# EAGLE design rc2014_16550 (EAGLE 8.1.0)
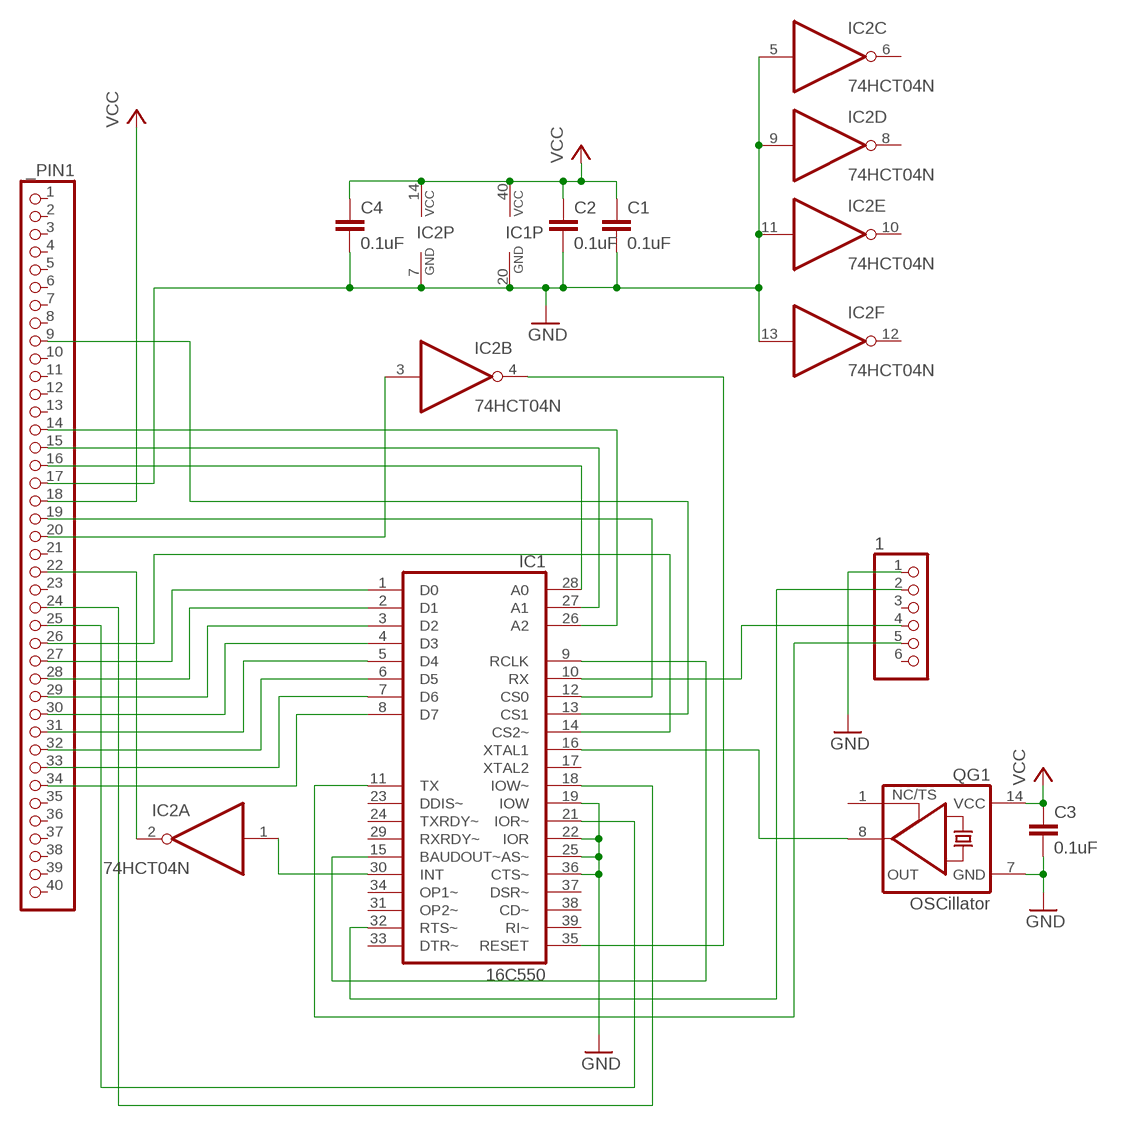
[diagram p0: schematic, sheet 1]

## Parts
1  PINHD-1X6  [1X06]
_PIN1  PINHD-1X40  [1X40]
C1  0.1uF  C-EU050-024X044  [C050-024X044]
C2  0.1uF  C-EU050-024X044  [C050-024X044]
C3  0.1uF  C-EU050-024X044  [C050-024X044]
C4  0.1uF  C-EU050-024X044  [C050-024X044]
IC1  16C550  XR-16C550P  [DIL40]
IC2  74HCT04N  [DIL14]
QG1  OSCillator  XO-14  [DIL14S]

## Nets
/INT: _PIN1.22 IC2.2(A:O)
/IORQ: _PIN1.26 IC1.14(CS2~)
/M1: _PIN1.19 IC1.12(CS0)
/RD: _PIN1.25 IC1.21(IOR~)
/RST: _PIN1.20 IC2.3(B:I)
/RTS: 1.2 IC1.32(RTS~)
/WR: _PIN1.24 IC1.18(IOW~)
A0: _PIN1.16 IC1.28(A0)
A1: _PIN1.15 IC1.27(A1)
A2: _PIN1.14 IC1.26(A2)
A7: _PIN1.9 IC1.13(CS1)
D0: _PIN1.27 IC1.1(D0)
D1: _PIN1.28 IC1.2(D1)
D2: _PIN1.29 IC1.3(D2)
D3: _PIN1.30 IC1.4(D3)
D4: _PIN1.31 IC1.5(D4)
D5: _PIN1.32 IC1.6(D5)
D6: _PIN1.33 IC1.7(D6)
D7: _PIN1.34 IC1.8(D7)
GND: 1.1 _PIN1.17 C1.2 C2.2 C3.2 C4.2 IC1.19(IOW) IC1.20(GND) IC1.22(IOR) IC1.25(AS~) IC1.36(CTS~) IC2.5(C:I) IC2.7(P:GND) IC2.9(D:I) IC2.11(E:I) IC2.13(F:I) QG1.7(GND)
INT: IC1.30(INT) IC2.1(A:I)
N$14: IC1.9(RCLK) IC1.15(BAUDOUT~)
OSC: IC1.16(XTAL1) QG1.8(OUT)
RESET: IC1.35(RESET) IC2.4(B:O)
RX: 1.4 IC1.10(RX)
TX: 1.5 IC1.11(TX)
VCC: _PIN1.18 C1.1 C2.1 C3.1 C4.1 IC1.40(VCC) IC2.14(P:VCC) QG1.14(VCC)
Unconnected: 1.3 1.6 _PIN1.1 _PIN1.2 _PIN1.3 _PIN1.4 _PIN1.5 _PIN1.6 _PIN1.7 _PIN1.8 _PIN1.10 _PIN1.11 _PIN1.12 _PIN1.13 _PIN1.21 _PIN1.23 _PIN1.35 _PIN1.36 _PIN1.37 _PIN1.38 _PIN1.39 _PIN1.40 IC1.17(XTAL2) IC1.23(DDIS~) IC1.24(TXRDY~) IC1.29(RXRDY~) IC1.31(OP2~) IC1.33(DTR~) IC1.34(OP1~) IC1.37(DSR~) IC1.38(CD~) IC1.39(RI~) IC2.6(C:O) IC2.8(D:O) IC2.10(E:O) IC2.12(F:O) QG1.1(TS)

## Library data of the parts
1 = pinhead:PINHD-1X6: PIN HEADER
_PIN1 = pinhead:PINHD-1X40: PIN HEADER
C1-C4 = rcl:C-EU: CAPACITOR, European symbol
IC1 = exar:XR-16C550P: UART/FIFO; MPN: ST16C450CP40; OC_FARNELL: 1294801; OC_NEWARK: 24R1445
IC2 = 74xx-eu:74*04: Hex INVERTER
QG1 = crystal:XO-: CRYSTAL; OC_FARNELL: unknown; OC_NEWARK: unknown

## Net classes
0 +5V: width 0.508 mm

## Board
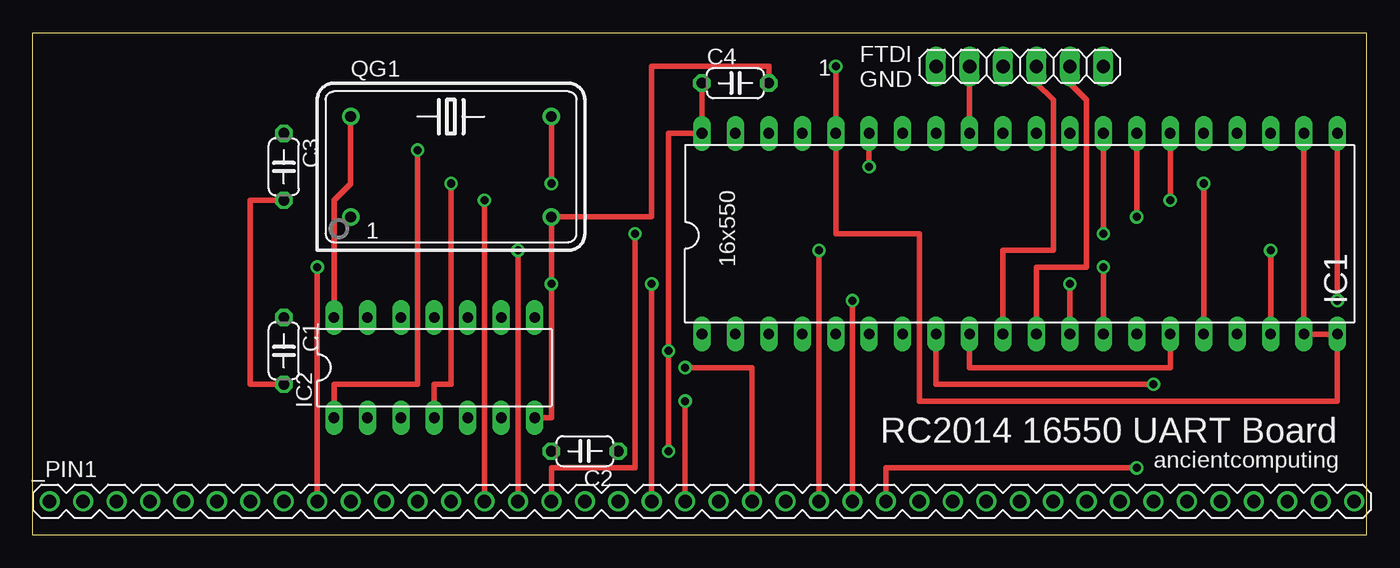
[diagram p1: board, top side]
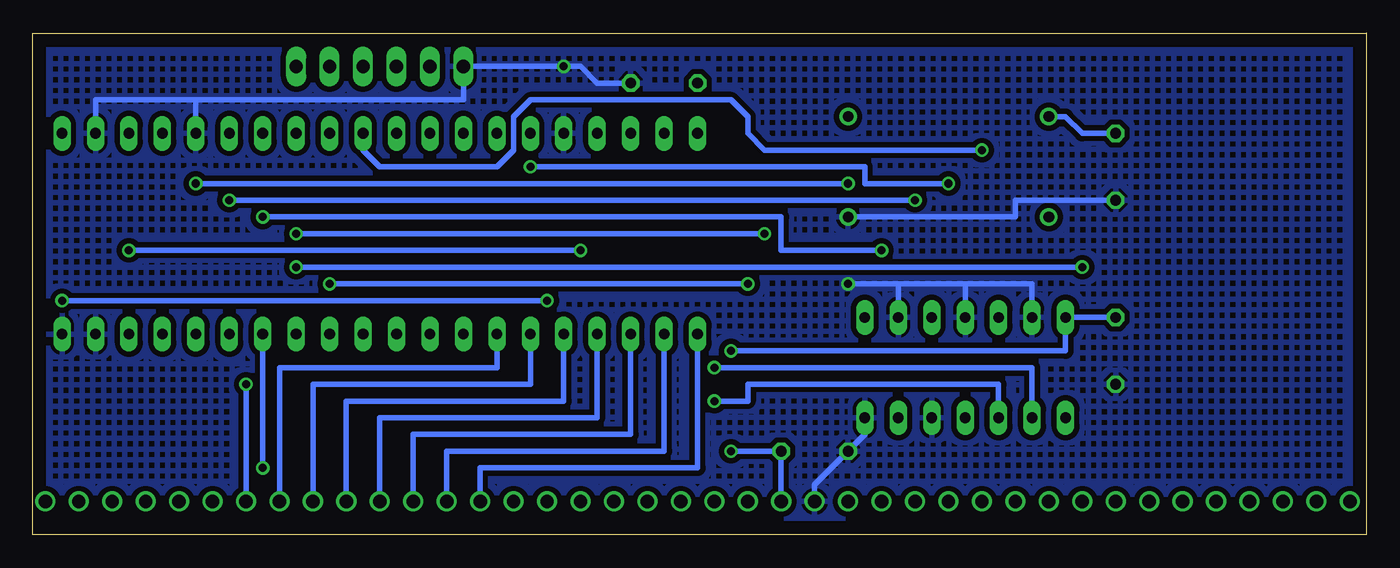
[diagram p2: board, bottom side, seen from below]

Size 101.27 x 38.1 mm. Coordinates in mm from the lower left corner, seen from the top.
Outline: 0,38.09 101.27,38.09 101.27,0 0,0 0,38.09
Outline: 0,38.09 0,38.1
Copper layers (1*16): Top 0.035mm / dielectric 1.5mm / Bottom 0.035mm
Design rules "default *": minimum track width 20mil, minimum drill 24mil, track to track 8mil, track to pad 8mil, pad to pad 8mil, via to via 8mil, smd to smd 8mil, copper to edge 40mil, drill to drill 8mil, minimum pad ring 10mil, minimum via ring 8mil, stop-mask expansion 4mil, vias tented up to drill 0mil, thermal gap 10mil

### Footprints (pad centres in the part's own frame; a part is rotated, then mirrored left to right if it is on the bottom)
1X06 = drill 1.016 long: 1 -6.35,0; 2 -3.81,0; 3 -1.27,0; 4 1.27,0; 5 3.81,0; 6 6.35,0
1X40 = drill 1.016: 1 -49.53,0; 2 -46.99,0; 3 -44.45,0; 4 -41.91,0; 5 -39.37,0; 6 -36.83,0; 7 -34.29,0; 8 -31.75,0; 9 -29.21,0; 10 -26.67,0; 11 -24.13,0; 12 -21.59,0; 13 -19.05,0; 14 -16.51,0; 15 -13.97,0; 16 -11.43,0; 17 -8.89,0; 18 -6.35,0; 19 -3.81,0; 20 -1.27,0; 21 1.27,0; 22 3.81,0; 23 6.35,0; 24 8.89,0; 25 11.43,0; 26 13.97,0; 27 16.51,0; 28 19.05,0; 29 21.59,0; 30 24.13,0; 31 26.67,0; 32 29.21,0; 33 31.75,0; 34 34.29,0; 35 36.83,0; 36 39.37,0; 37 41.91,0; 38 44.45,0; 39 46.99,0; 40 49.53,0
C050-024X044 = drill 0.813 octagon: 1 -2.54,0; 2 2.54,0
DIL40 = drill 0.813 long: 1 -24.13,-7.62; 2 -21.59,-7.62; 3 -19.05,-7.62; 4 -16.51,-7.62; 5 -13.97,-7.62; 6 -11.43,-7.62; 7 -8.89,-7.62; 8 -6.35,-7.62; 9 -3.81,-7.62; 10 -1.27,-7.62; 11 1.27,-7.62; 12 3.81,-7.62; 13 6.35,-7.62; 14 8.89,-7.62; 15 11.43,-7.62; 16 13.97,-7.62; 17 16.51,-7.62; 18 19.05,-7.62; 19 21.59,-7.62; 20 24.13,-7.62; 21 24.13,7.62; 22 21.59,7.62; 23 19.05,7.62; 24 16.51,7.62; 25 13.97,7.62; 26 11.43,7.62; 27 8.89,7.62; 28 6.35,7.62; 29 3.81,7.62; 30 1.27,7.62; 31 -1.27,7.62; 32 -3.81,7.62; 33 -6.35,7.62; 34 -8.89,7.62; 35 -11.43,7.62; 36 -13.97,7.62; 37 -16.51,7.62; 38 -19.05,7.62; 39 -21.59,7.62; 40 -24.13,7.62
DIL14 = drill 0.813 long: 1 -7.62,-3.81; 2 -5.08,-3.81; 3 -2.54,-3.81; 4 0,-3.81; 5 2.54,-3.81; 6 5.08,-3.81; 7 7.62,-3.81; 8 7.62,3.81; 9 5.08,3.81; 10 2.54,3.81; 11 0,3.81; 12 -2.54,3.81; 13 -5.08,3.81; 14 -7.62,3.81
DIL14S = drill 0.813: 1 -7.62,-3.81; 7 7.62,-3.81; 8 7.62,3.81; 14 -7.62,3.81

### Placement (x,y rotation side)
1  74.93,35.56 0 top
_PIN1  50.8,2.54 0 top
C1  19.05,13.97 270 top
C2  41.91,6.35 180 top
C3  19.05,27.94 270 top
C4  53.34,34.29 0 top
IC1  74.93,22.86 0 top
IC2  30.48,12.7 0 top
QG1  31.75,27.94 0 top

### Tracks (layer width: path | path; a pad name or v marks a point on that pad's centre or on a via)
/INT  (via drill 0.61)
  Top 0.406: _PIN1.22 54.61,12.7 v49.53,12.7
  Bottom 0.406: v49.53,12.7 25.4,12.7 IC2.2
/IORQ  (via drill 0.61)
  Top 0.406: v83.82,5.08 64.77,5.08 _PIN1.26
  Bottom 0.406: IC1.14 v83.82,5.08
/M1  (via drill 0.61)
  Top 0.406: _PIN1.19 v46.99,19.05 | v78.74,19.05 IC1.12
  Bottom 0.406: v46.99,19.05 v78.74,19.05
/RD  (via drill 0.61)
  Top 0.406: _PIN1.25 v62.23,17.78 | IC1.21 v99.06,17.78
  Bottom 0.406: v99.06,17.78 v62.23,17.78
/RST  (via drill 0.61)
  Top 0.406: _PIN1.20 v49.53,10.16
  Bottom 0.406: IC2.3 27.94,11.43 46.99,11.43 46.99,10.16 v49.53,10.16
/RTS
  Top 0.406: 1.2 IC1.32
/WR  (via drill 0.61)
  Top 0.406: _PIN1.24 v59.69,21.59 | v93.98,21.59 IC1.18
  Bottom 0.406: v59.69,21.59 v93.98,21.59
A0  (via drill 0.61)
  Top 0.406: v45.72,22.86 45.72,5.08 39.37,5.08 _PIN1.16 | IC1.28 v81.28,22.86
  Bottom 0.406: v45.72,22.86 v81.28,22.86
A1  (via drill 0.61)
  Top 0.406: _PIN1.15 v36.83,21.59 | IC1.27 v83.82,24.13
  Bottom 0.406: v36.83,21.59 44.45,21.59 44.45,24.13 v83.82,24.13
A2  (via drill 0.61)
  Top 0.406: _PIN1.14 v34.29,25.4 | IC1.26 v86.36,25.4
  Bottom 0.406: v34.29,25.4 v86.36,25.4
A7  (via drill 0.61)
  Top 0.406: v21.59,20.32 _PIN1.9 | v81.28,20.32 IC1.13
  Bottom 0.406: v21.59,20.32 v81.28,20.32
D0
  Bottom 0.406: _PIN1.27 67.31,5.08 50.8,5.08 IC1.1
D1
  Bottom 0.406: _PIN1.28 69.85,6.35 53.34,6.35 IC1.2
D2
  Bottom 0.406: _PIN1.29 72.39,7.62 55.88,7.62 IC1.3
D3
  Bottom 0.406: IC1.4 58.42,8.89 74.93,8.89 _PIN1.30
D4
  Bottom 0.406: _PIN1.31 77.47,10.16 60.96,10.16 IC1.5
D5
  Bottom 0.406: IC1.6 63.5,11.43 80.01,11.43 _PIN1.32
D6
  Bottom 0.406: _PIN1.33 82.55,12.7 66.04,12.7 IC1.7
D7  (via drill 0.61)
  Top 0.406: IC1.8 68.58,11.43 v85.09,11.43
  Bottom 0.406: v85.09,11.43 _PIN1.34
GND  (via drill 0.61)
  Top 0.406: IC1.22 IC1.19 IC1.20 99.06,10.16 67.31,10.16 67.31,22.86 60.96,22.86 IC1.36 v60.96,35.56 | IC2.7 39.37,8.89 v39.37,19.05 QG1.7 46.99,24.13 46.99,35.56 55.88,35.56 C4.2 | C1.2 16.51,11.43 16.51,25.4 C3.2
  Bottom 0.406: _PIN1.17 41.91,3.81 C2.2 38.1,7.62 IC2.7 | QG1.7 26.67,24.13 26.67,25.4 C3.2 | 88.9,33.02 68.58,33.02 1.1 v60.96,35.56 59.69,35.56 58.42,34.29 C4.2 | 88.9,33.02 IC1.25 | 88.9,33.02 96.52,33.02 IC1.22 | IC2.13 25.4,19.05 30.48,19.05 | 30.48,19.05 IC2.11 | 30.48,19.05 35.56,19.05 | 35.56,19.05 IC2.9 | 35.56,19.05 v39.37,19.05
  pour Bottom (isolate 0.406, hatched): 0,38.1 0,0 101.6,0 101.6,38.1
INT  (via drill 0.61)
  Top 0.406: IC2.1 22.86,11.43 29.21,11.43 v29.21,29.21
  Bottom 0.406: IC1.30 76.2,29.21 74.93,27.94 66.04,27.94 64.77,29.21 64.77,31.75 63.5,33.02 48.26,33.02 46.99,31.75 46.99,30.48 45.72,29.21 v29.21,29.21
N$14
  Top 0.406: IC1.15 86.36,12.7 71.12,12.7 IC1.9
OSC  (via drill 0.61)
  Top 0.406: QG1.8 v39.37,26.67 | v88.9,26.67 IC1.16
  Bottom 0.406: v39.37,26.67 v88.9,26.67
RESET  (via drill 0.61)
  Top 0.406: IC2.4 30.48,11.43 31.75,11.43 v31.75,26.67 | IC1.35 v63.5,27.94
  Bottom 0.406: v31.75,26.67 38.1,26.67 38.1,27.94 v63.5,27.94
RX
  Top 0.406: 1.4 76.2,34.29 77.47,33.02 77.47,21.59 73.66,21.59 IC1.10
TX
  Top 0.406: 1.5 78.74,34.29 80.01,33.02 80.01,20.32 76.2,20.32 IC1.11
VCC  (via drill 0.61)
  Top 0.406: v48.26,6.35 v48.26,13.97 48.26,30.48 IC1.40 C4.1 | QG1.14 24.13,26.67 22.86,25.4 IC2.14
  Bottom 0.406: C1.1 IC2.14 22.86,13.97 v48.26,13.97 | C3.1 21.59,30.48 22.86,31.75 QG1.14 | _PIN1.18 C2.1 v48.26,6.35

### Text on the board
tNames: FTDI / GND | 16x550 | RC2014 16550 UART Board | ancientcomputing